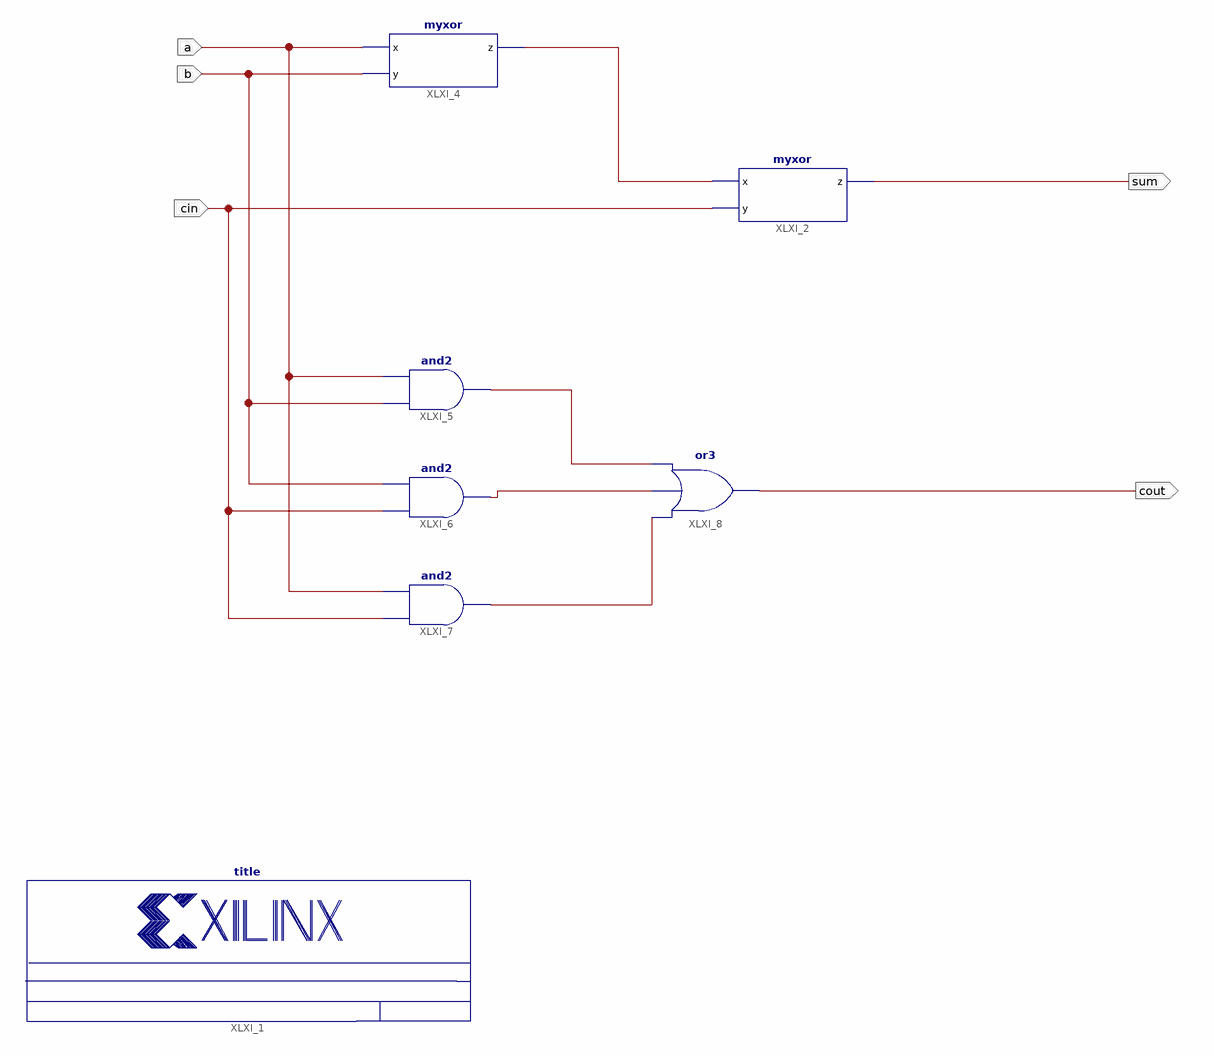
[diagram p0: schematic sheet 1]
// Xilinx ISE schematic full_adder_sch.sch (spartan3e) as structural Verilog: 7 symbols, 5 ports
module full_adder_sch (
  input  a,
  input  b,
  input  cin,
  output sum,
  output cout
);

  wire XLXN_3, XLXN_10, XLXN_12, XLXN_13;

  title #(.NameFieldText("Full adder")) XLXI_1 ();
  myxor XLXI_2 (.x(XLXN_3), .y(cin), .z(sum));
  myxor XLXI_4 (.x(a), .y(b), .z(XLXN_3));
  and XLXI_5 (XLXN_10, b, a);
  and XLXI_6 (XLXN_12, cin, b);
  and XLXI_7 (XLXN_13, cin, a);
  or XLXI_8 (cout, XLXN_13, XLXN_12, XLXN_10);
endmodule
